# EAGLE schematic Okapi (EAGLE 9.6.2), part 1 of 2

## Sheet 1 of 6
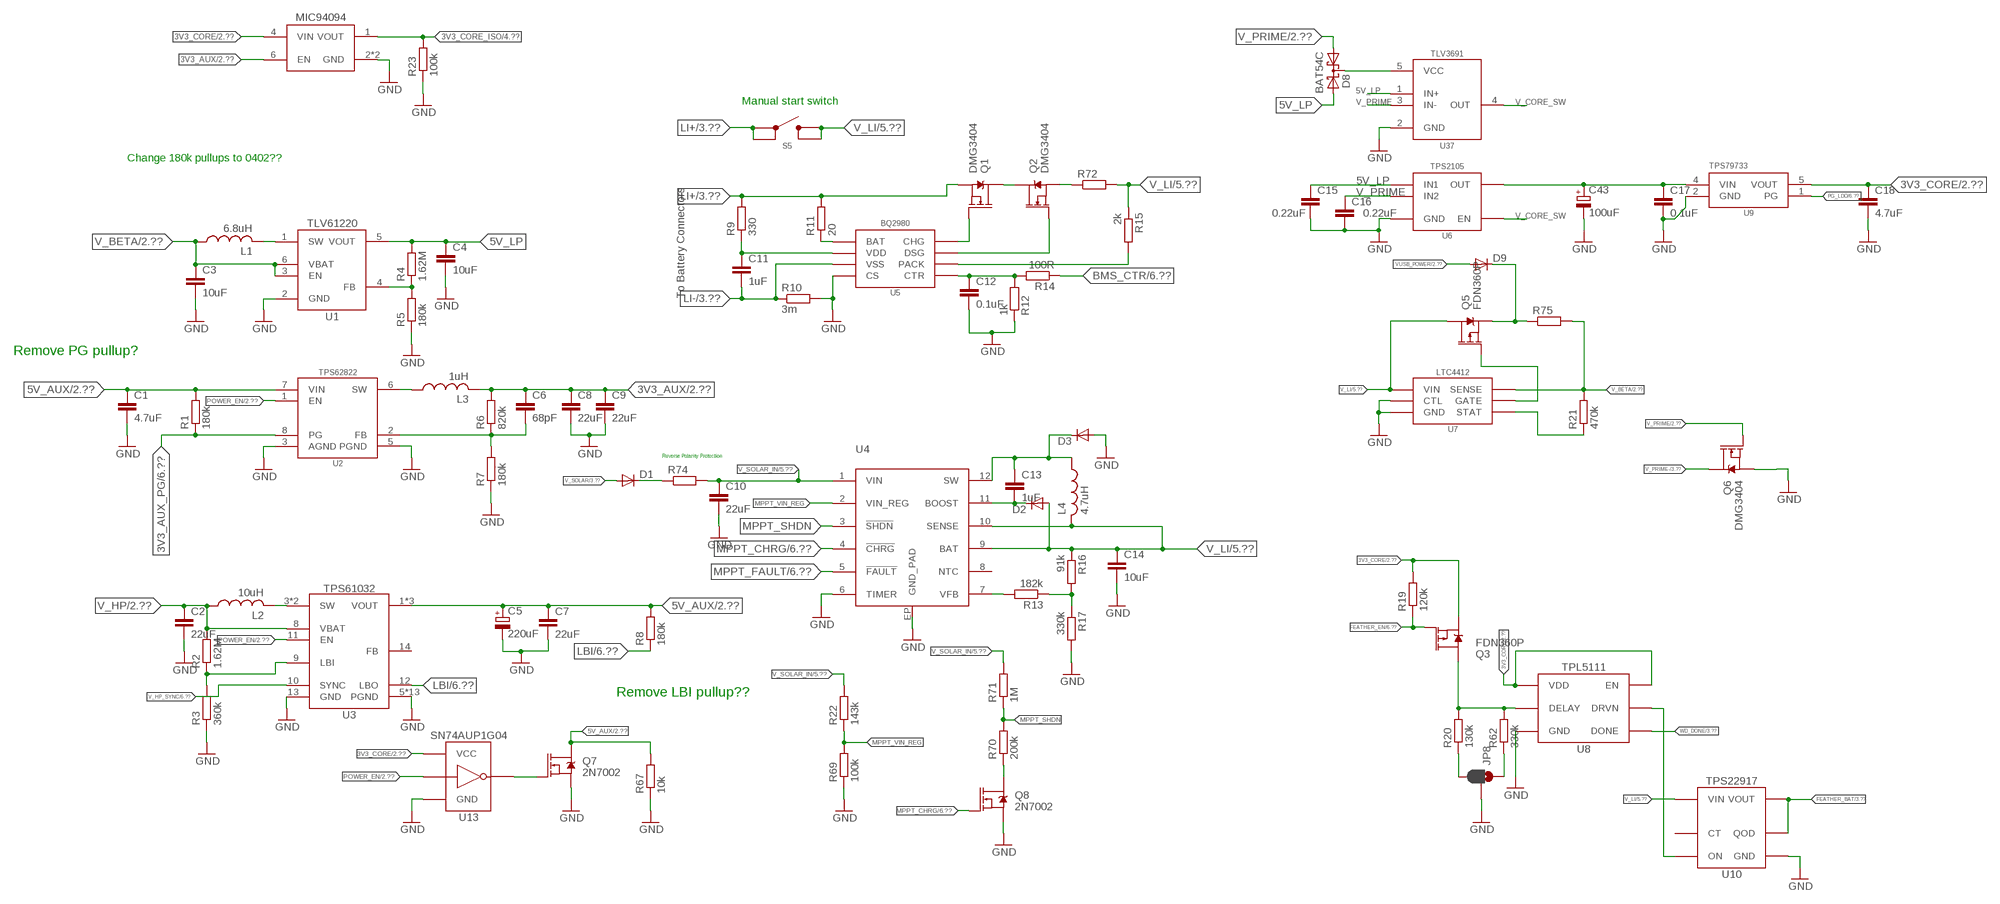
[diagram p0: schematic, sheet 1]

### Parts
C1  4.7uF  C-EU4.7UFC0805  [C0805]
C2  22uF  C-EU22UFC0805  [C0805]
C3  10uF  C-EU10UFC0805  [C0805]
C4  10uF  C-EU10UFC0805  [C0805]
C5  220uF  CTANT_EU2917  [C2917]
C6  68pF  C-EU68PFC0402  [C0402]
C7  22uF  C-EU22UFC0805  [C0805]
C8  22uF  C-EU22UFC0805  [C0805]
C9  22uF  C-EU22UFC0805  [C0805]
C10  22uF  C-EU22UFC0805  [C0805]
C11  1uF  C-EU1UFC0603  [C0603]
C12  0.1uF  C-EU0.1UFC0402  [C0402]
C13  1uF  C-EU1UFC0603  [C0603]
C14  10uF  C-EU10UFC0805  [C0805]
C15  0.22uF  C-EU0.22UFC0402  [C0402]
C16  0.22uF  C-EU0.22UFC0402  [C0402]
C17  0.1uF  C-EU0.1UFC0402  [C0402]
C18  4.7uF  C-EU4.7UFC0603  [C0603]
C43  100uF  CTANT_EU1206  [C1206_TANT]
D1  DIODEDO-214AC  [DO214AC]
D2  DIODESOD-323  [SOD323-R]
D3  DIODEDO-214AC  [DO214AC]
D8  BAT54C  [SOT23-3@1]
D9  DIODEDO-214AC  [DO214AC]
JP8  JUMPER-SMT_3_1-NC_PASTE_SILK  [SMT-JUMPER_3_1-NC_PASTE_SILK]
L1  6.8uH  INDUCTOR_1008  [1008]
L2  10uH  INDUCTOR_XHMI_6.65X6.45  [WE-XHMI(6.65X6.45)]
L3  1uH  INDUCTOR_LQS_3X3  [WE-LQS(3X3)]
L4  4.7uH  INDUCTOR_MAIA_4.1X4.1  [WE-MAIA(4.1X4.1)]
Q1  DMG3404  MOSFET-NCH-DMG3404L  [SOT23-3]
Q2  DMG3404  MOSFET-NCH-DMG3404L  [SOT23-3]
Q3  FDN360P  MOSFET_PCH-FDN360P  [SOT23-3@1]
Q5  FDN360P  MOSFET_PCH-FDN360P  [SOT23-3@1]
Q6  DMG3404  MOSFET-NCH-DMG3404L  [SOT23-3]
Q7  2N7002  MOSFET-NCH-2N7002PW  [SOT323]
Q8  2N7002  MOSFET-NCH-2N7002PW  [SOT323]
R1  180k  R-EU_180KR0603  [R0603]
R2  1.62M  R-EU_1.62MR0603  [R0603]
R3  360k  R-EU_360KR0603  [R0603]
R4  1.62M  R-EU_1.62MR0603  [R0603]
R5  180k  R-EU_180KR0603  [R0603]
R6  820k  R-EU_820KR0603  [R0603]
R7  180k  R-EU_180KR0603  [R0603]
R8  180k  R-EU_180KR0603  [R0603]
R9  330  R-EU_330R0402  [R0402]
R10  3m  R-EU_0.003R0805  [R0805]
R11  20  R-EU_20R0402  [R0402]
R12  1k  R-EU_1KR0402  [R0402]
R13  182k  R-EU_182KR0603  [R0603]
R14  100R  R-EU_100R0402  [R0402]
R15  2k  R-EU_2KR0402  [R0402]
R16  91k  R-EU_91KR0603  [R0603]
R17  330k  R-EU_330KR0603  [R0603]
R19  120k  R-EU_120KR0402  [R0402]
R20  130k  R-EU_130KR0603  [R0603]
R21  470k  R-EU_470KR0603  [R0603]
R22  143k  R-EU_143KR0603  [R0603]
R23  100k  R-EU_100KR0402  [R0402]
R62  330k  R-EU_330KR0603  [R0603]
R67  10k  R-EU_10KR0402  [R0402]
R69  100k  R-EU_100KR0603  [R0603]
R70  200k  R-EU_200KR0603  [R0603]
R71  1M  R-EU_1MR0603  [R0603]
R72  R-EU_R0805  [R0805]
R74  R-EU_R0805  [R0805]
R75  R-EU_R0805  [R0805]
S5  BUTTON2.6X1.6  [SWITCH_2.6X1.6]
U1  TLV61220DBV  [DBV_R-PDSO-G6]
U2  TPS62822DLC  [DLC_8]
U3  TPS61032RSA  [RSA_S-PVQFN-N16]
U4  LT3652DD  [DFN_12_3X3]
U5  BQ2980RUG  [RUG_S-PQFP-N8]
U6  TPS2105  [SOT23-5]
U7  LTC4412S6  [SOT23-6L]
U8  TPL5111DDC  [DDC_R-PDSO-G6]
U9  TPS79733  [DCK_R-PDSO-G5]
U10  TPS22917DBV  [DBV_R-PDSO-G6]
U13  SN74AUP1G04YFP  [DSBGD_4]
U37  TLV3691DCK  [DCK_R-PDSO-G5]
U39  MIC94094C6  [SC-70_6]

### Nets
3V3_AUX: C6.1 C8.1 C9.1 L3.P$2 R6.2 U39.6(EN) ; also sheet 2,3,4,5
3V3_AUX_PG: R1.1 U2.8(PG) ; also sheet 6
3V3_CORE: C18.1 Q3.2(S) R19.2 U8.1(VDD) U8.6(EN) U9.5(VOUT) U13.A2(VCC) U39.4(VIN) ; also sheet 2,3,4,5,6
3V3_CORE_ISO: R23.2 U39.1(VOUT) ; also sheet 4,6
5V_AUX: C1.1 C5.+ C7.1 Q7.3(D) R1.2 R8.2 R67.2 U2.7(VIN) U3.1(VOUT) U3.15(VOUT) U3.16(VOUT) ; also sheet 2,3,4,5,6
5V_LP: C4.1 C15.1 D8.2(A2) R4.2 U1.5(VOUT) U6.5(IN1) U37.1(IN+)
BMS_CTR: R14.1 ; also sheet 6
FEATHER_BAT: U10.5(QOD) U10.6(VOUT) ; also sheet 3
FEATHER_EN: Q3.1(G) R19.1 ; also sheet 6
GND: C1.2 C2.2 C3.2 C4.2 C5.- C7.2 C8.2 C9.2 C10.2 C12.2 C14.2 C15.2 C16.2 C17.2 C18.2 C43.- D3.A JP8.2 Q6.2(S) Q7.2(S) Q8.2(S) R3.1 R5.1 R7.1 R10.2 R12.1 R17.2 R23.1 R67.1 R69.1 U1.2(GND) U2.3(AGND) U2.5(PGND) U3.5(PGND) U3.6(PGND) U3.7(PGND) U3.13(GND) U3.PAD(PGND) U3.PAD@1(PGND) U3.PAD@2(PGND) U3.PAD@3(PGND) U3.PAD@4(PGND) U3.PAD@5(PGND) U3.PAD@6(PGND) U3.PAD@7(PGND) U3.PAD@8(PGND) U3.PAD@9(PGND) U4.6(TIMER) U4.EP(GND_PAD) U5.4(CS) U6.2(GND) U7.2(GND) U7.3(CTL) U8.2(GND) U9.2(GND) U10.2(GND) U13.B1(GND) U37.2(GND) U39.2(GND) U39.5(GND) ; also sheet 2,3,4,5,6
LBI: R8.1 U3.12(LBO) ; also sheet 6
LI+: Q1.2(S) R9.2 R11.2 S5.A S5.A' ; also sheet 3
LI-: C11.2 R10.1 U5.3(VSS) ; also sheet 3
MPPT_CHRG: Q8.1(G) U4.4(!CHRG) ; also sheet 6
MPPT_FAULT: U4.5(!FAULT) ; also sheet 6
MPPT_SHDN: R70.2 R71.1 U4.3(!SHDN)
MPPT_VIN_REG: R22.1 R69.2 U4.2(VIN_REG)
N$2: L3.P$1 U2.6(SW)
N$3: C6.2 R6.1 R7.2 U2.2(FB)
N$4: R2.1 R3.2 U3.9(LBI)
N$5: L2.2 U3.3(SW) U3.4(SW)
N$6: Q1.3(D) Q2.3(D)
N$7: R4.1 R5.2 U1.4(FB)
N$8: Q1.1(G) U5.8(CHG)
N$9: L1.2 U1.1(SW)
N$10: Q2.1(G) U5.7(DSG)
N$11: R15.2 U5.6(PACK)
N$12: R13.1 R16.2 R17.1
N$13: C12.1 R12.2 R14.2 U5.5(CTR)
N$14: R11.1 U5.1(BAT)
N$15: R13.2 U4.7(VFB)
N$16: C11.1 R9.1 U5.2(VDD)
N$18: C13.2 D2.C U4.11(BOOST)
N$19: JP8.3 R20.1
N$20: C13.1 D3.C L4.P$1 U4.12(SW)
N$22: Q8.3(D) R70.1
N$42: JP8.1 R62.1
N$45: Q5.1(G) U7.5(GATE)
N$46: R21.1 U7.4(STAT)
N$63: Q3.3(D) R20.2 R62.2 U8.3(DELAY)
N$64: U8.5(DRVN) U10.3(ON)
N$68: Q7.1(G) U13.B2(Y)
N$69: D8.3(C) U37.5(VCC)
PG_LDO: U9.1(PG) ; also sheet 6
POWER_EN: U2.1(EN) U3.11(EN) U13.A1(A) ; also sheet 2
V_BETA: C3.1 L1.1 R21.2 R75.2 U1.3(EN) U1.6(VBAT) U7.6(SENSE) ; also sheet 2,5
V_BETA_SENSE: D9.C Q5.2(S) R75.1 ; also sheet 5
V_CORE: C17.1 C43.+ U6.4(OUT) U9.4(VIN)
V_CORE_SW: U6.1(EN) U37.4(OUT)
V_HP: C2.1 L2.1 R2.2 U3.8(VBAT) ; also sheet 2
V_HP_SYNC: U3.10(SYNC) ; also sheet 6
V_LI: C14.1 D2.A L4.P$2 Q5.3(D) R15.1 R16.1 R72.2 S5.B S5.B' U4.9(BAT) U4.10(SENSE) U7.1(VIN) U10.1(VIN) ; also sheet 5
V_LI_SENSE: Q2.2(S) R72.1 ; also sheet 5
V_PRIME: C16.1 D8.1(A1) Q6.1(G) U6.3(IN2) U37.3(IN-) ; also sheet 2,3,5
V_PRIME-: Q6.3(D) ; also sheet 3
V_SOLAR: D1.A ; also sheet 3
V_SOLAR_IN: C10.1 R22.2 R71.2 R74.2 U4.1(VIN) ; also sheet 5
V_SOLAR_SENSE: D1.C R74.1 ; also sheet 5
VUSB_POWER: D9.A ; also sheet 2,6
WD_DONE: U8.4(DONE) ; also sheet 3
Unconnected: U3.14(FB) U4.8(NTC) U10.4(CT)

### Notes on the sheet
- Manual start switch
- Change 180k pullups to 0402??
- To Battery Connectors
- Remove PG pullup?
- Reverse Polarity Protection
- Remove LBI pullup??

## Sheet 2 of 6
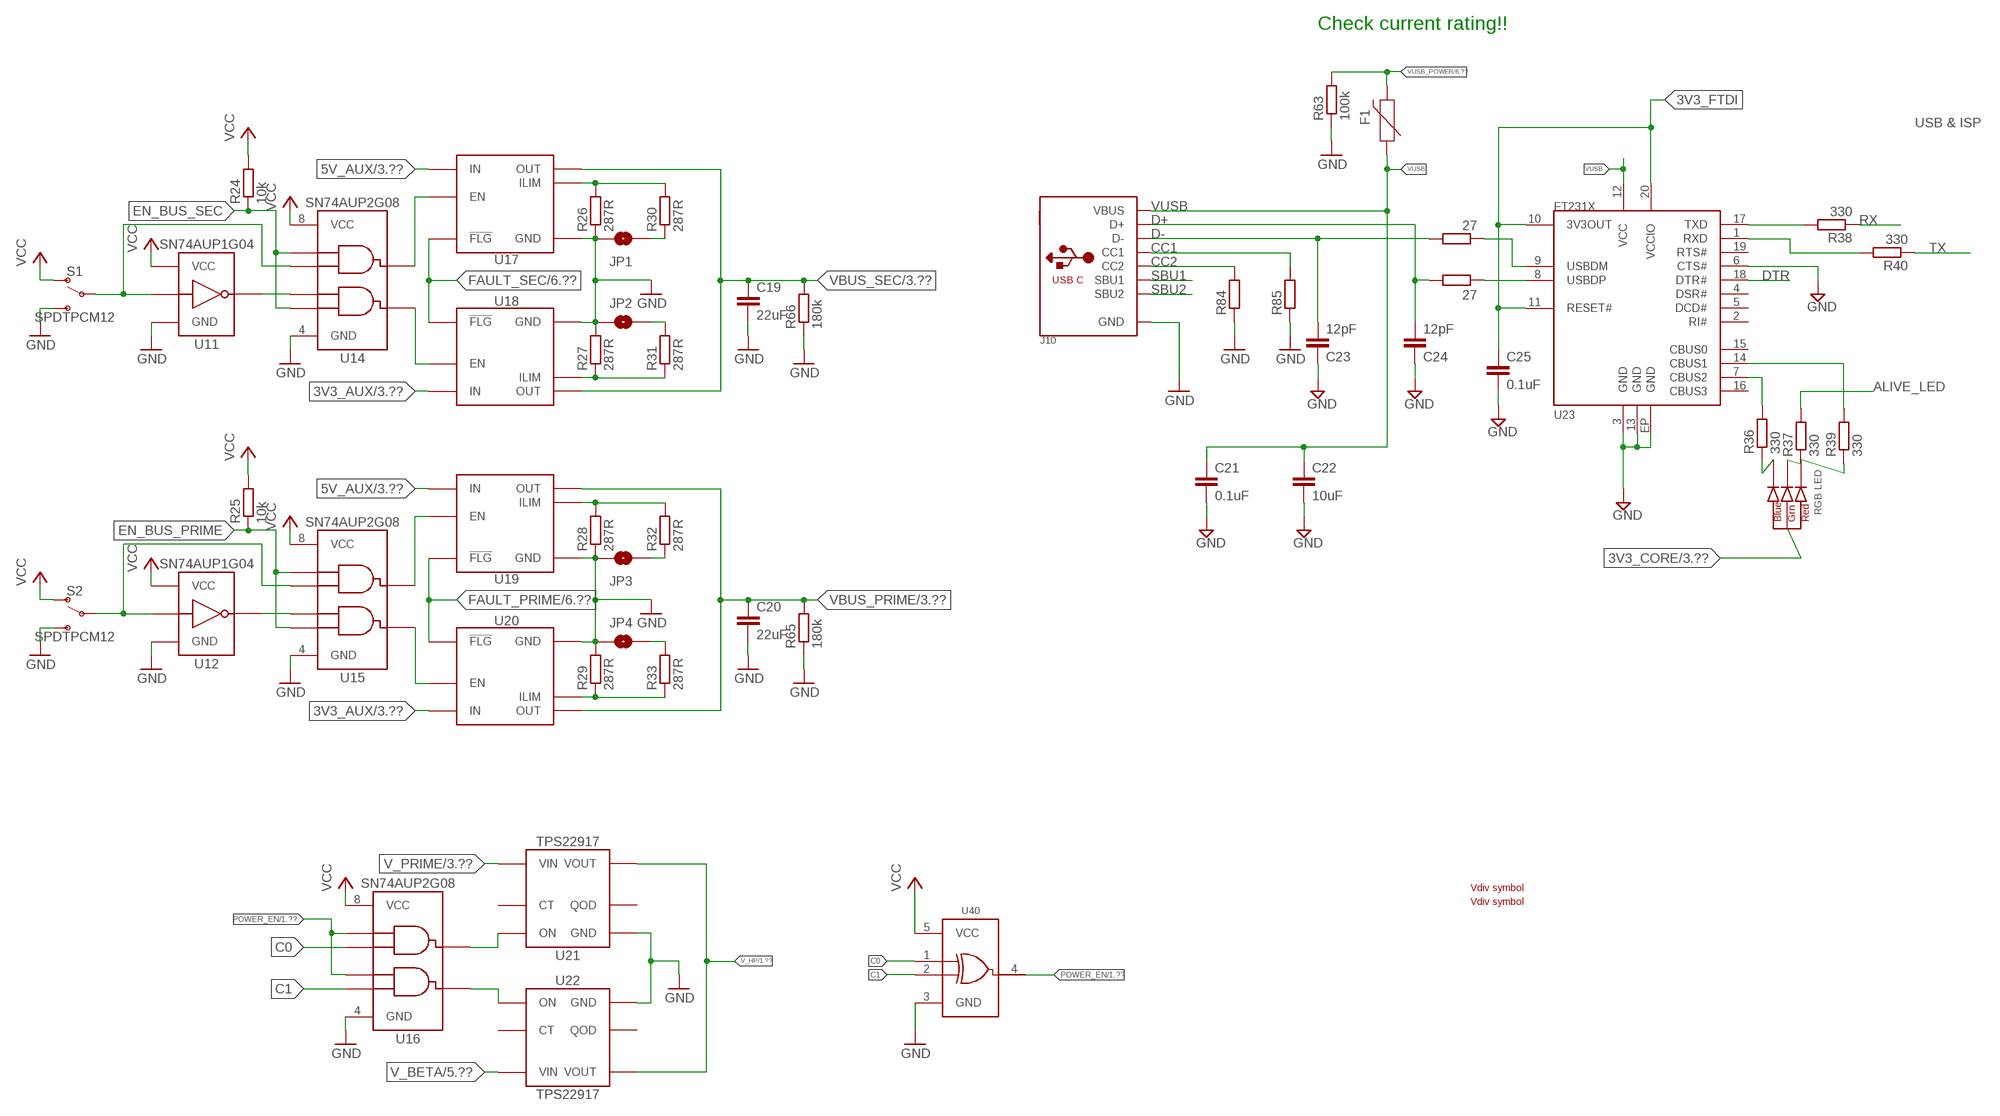
[diagram p1: schematic, sheet 2]

### Parts
C19  22uF  C-EU22UFC0805  [C0805]
C20  22uF  C-EU22UFC0805  [C0805]
C21  0.1uF  C-EU0.1UFC0402  [C0402]
C22  10uF  C-EU10UFC0805  [C0805]
C23  12pF  C-EU12PFC0402  [C0402]
C24  12pF  C-EU12PFC0402  [C0402]
C25  0.1uF  C-EU0.1UFC0402  [C0402]
D4  CLVBA-FKA  [CLVBA-FKA]
F1  PPTC1.5A  [1206]
J10  USB_C  [USB_C_CUSB31-CFM2AX-01-X]
JP1  JUMPER-SMT_2_NO_SILK  [SMT-JUMPER_2_NO_SILK]
JP2  JUMPER-SMT_2_NO_SILK  [SMT-JUMPER_2_NO_SILK]
JP3  JUMPER-SMT_2_NO_SILK  [SMT-JUMPER_2_NO_SILK]
JP4  JUMPER-SMT_2_NO_SILK  [SMT-JUMPER_2_NO_SILK]
R24  10k  R-EU_10KR0402  [R0402]
R25  10k  R-EU_10KR0402  [R0402]
R26  287R  R-EU_232R0402  [R0402]
R27  287R  R-EU_232R0402  [R0402]
R28  287R  R-EU_232R0402  [R0402]
R29  287R  R-EU_232R0402  [R0402]
R30  287R  R-EU_453R0402  [R0402]
R31  287R  R-EU_453R0402  [R0402]
R32  287R  R-EU_453R0402  [R0402]
R33  287R  R-EU_453R0402  [R0402]
R34  27  R-EU_27R0402  [R0402]
R35  27  R-EU_27R0402  [R0402]
R36  330  R-EU_330R0402  [R0402]
R37  330  R-EU_330R0402  [R0402]
R38  330  R-EU_330R0402  [R0402]
R39  330  R-EU_330R0402  [R0402]
R40  330  R-EU_330R0402  [R0402]
R63  100k  R-EU_100KR0402  [R0402]
R65  180k  R-EU_180KR0402  [R0402]
R66  180k  R-EU_180KR0402  [R0402]
R84  R-EU_5.1KR0402  [R0402]
R85  R-EU_5.1KR0402  [R0402]
S1  SPDTPCM12  [PCM12]
S2  SPDTPCM12  [PCM12]
U11  SN74AUP1G04YFP  [DSBGD_4]
U12  SN74AUP1G04YFP  [DSBGD_4]
U14  SN74AUP2G08DQE  [DQE_R-PX2SON-N8]
U15  SN74AUP2G08DQE  [DQE_R-PX2SON-N8]
U16  SN74AUP2G08DQE  [DQE_R-PX2SON-N8]
U17  MIC2544MSOP  [MSOP_8]
U18  MIC2544MSOP  [MSOP_8]
U19  MIC2544MSOP  [MSOP_8]
U20  MIC2544MSOP  [MSOP_8]
U21  TPS22917DBV  [DBV_R-PDSO-G6]
U22  TPS22917DBV  [DBV_R-PDSO-G6]
U23  FT231X-Q  [QFN20]
U40  SN74AHC1G86DCK  [DCK_R-PDSO-G5]
U$1  VDIV-JP  [VDIV_GENERIC]
U$2  VDIV-JP  [VDIV_GENERIC]

### Nets
3V3_AUX: R24.2 R25.2 S1.1(O) S2.1(O) U11.A2(VCC) U12.A2(VCC) U14.8(VCC) U15.8(VCC) U18.7(IN) U20.7(IN) ; supply symbol labelled VCC ; also sheet 1,3,4,5
3V3_CORE: D4.2(ANODE) U16.8(VCC) U40.5(VCC) ; supply symbol labelled VCC ; also sheet 1,3,4,5,6
3V3_FTDI: C25.1 U23.10(3V3OUT) U23.11(RESET#) U23.20(VCCIO)
5V_AUX: U17.7(IN) U19.7(IN) ; also sheet 1,3,4,5,6
ALIVE_LED: R37.2 ; also sheet 6
C0: U16.2(B1) U40.1(A) ; also sheet 6
C1: U16.6(B2) U40.2(B) ; also sheet 6
CC1: J10.A5(CC1) R85.2
CC2: J10.B5(CC2) R84.2
D+: C24.2 J10.A6(D+) J10.B6(D+) R35.2
D-: C23.2 J10.A7(D-) J10.B7(D-) R34.2
DTR: U23.18(DTR#) ; also sheet 6
EN_BUS_PRIME: R25.1 U15.1(A1) U15.6(B2) ; also sheet 6
EN_BUS_SEC: R24.1 U14.1(A1) U14.6(B2) ; also sheet 6
FAULT_PRIME: U19.2(!FLG) U20.2(!FLG) ; also sheet 6
FAULT_SEC: U17.2(!FLG) U18.2(!FLG) ; also sheet 6
GND: C19.2 C20.2 C21.2 C22.2 C23.1 C24.1 C25.2 J10.A1B12(GND) J10.B1A12(GND) JP1.1 JP2.1 JP3.1 JP4.1 R26.1 R27.2 R28.1 R29.2 R63.1 R65.1 R66.1 R84.1 R85.1 S1.3(S) S2.3(S) U11.B1(GND) U12.B1(GND) U14.4(GND) U15.4(GND) U16.4(GND) U17.3(GND) U18.3(GND) U19.3(GND) U20.3(GND) U21.2(GND) U22.2(GND) U23.3(GND) U23.6(CTS#) U23.13(GND) U23.EP(GND) U40.3(GND) ; also sheet 1,3,4,5,6
N$23: U16.7(Y1) U21.3(ON)
N$24: U16.3(Y2) U22.3(ON)
N$26: U12.B2(Y) U15.5(A2)
N$27: R28.2 R32.2 U19.5(ILIM)
N$28: S2.2(P) U12.A1(A) U15.2(B1)
N$29: U15.7(Y1) U19.1(EN)
N$30: U15.3(Y2) U20.1(EN)
N$31: JP3.2 R32.1
N$32: JP4.2 R33.2
N$33: R29.1 R33.1 U20.5(ILIM)
N$34: U11.B2(Y) U14.5(A2)
N$35: S1.2(P) U11.A1(A) U14.2(B1)
N$36: U14.7(Y1) U17.1(EN)
N$37: U14.3(Y2) U18.1(EN)
N$38: R26.2 R30.2 U17.5(ILIM)
N$39: JP1.2 R30.1
N$40: JP2.2 R31.2
N$41: R27.1 R31.1 U18.5(ILIM)
N$44: R38.2 U23.17(TXD)
N$47: R40.2 U23.1(RXD)
N$50: R35.1 U23.8(USBDP)
N$51: R39.2 U23.14(CBUS1)
N$52: R34.1 U23.9(USBDM)
N$53: D4.1(RED_CATH) R39.1
N$54: D4.3(BLUE_CATH) R36.1
N$56: D4.4(GREEN_CATH) R37.1
N$57: R36.2 U23.7(CBUS2)
POWER_EN: U16.1(A1) U16.5(A2) U40.4(Y) ; also sheet 1
RX: R38.1 ; also sheet 3,6
SBU1: J10.A8(SBU1)
SBU2: J10.B8(SBU2)
TX: R40.1 ; also sheet 3,6
V_BETA: U22.1(VIN) ; also sheet 1,5
V_HP: U21.6(VOUT) U22.6(VOUT) ; also sheet 1
V_PRIME: U21.1(VIN) ; also sheet 1,3,5
VBUS_PRIME: C20.1 R65.2 U19.6(OUT) U19.8(OUT) U20.6(OUT) U20.8(OUT) ; also sheet 3,4
VBUS_SEC: C19.1 R66.2 U17.6(OUT) U17.8(OUT) U18.6(OUT) U18.8(OUT) ; also sheet 3,4
VUSB: C21.1 C22.1 F1.1 J10.A4B9(VBUS) J10.B4A9(VBUS) U23.12(VCC)
VUSB_POWER: F1.2 R63.2 ; also sheet 1,6
Unconnected: U21.4(CT) U22.4(CT) U23.2(RI#) U23.4(DSR#) U23.5(DCD#) U23.15(CBUS0) U23.16(CBUS3) U23.19(RTS#)

### Notes on the sheet
- Check current rating!!
- USB & ISP

## Sheet 3 of 6
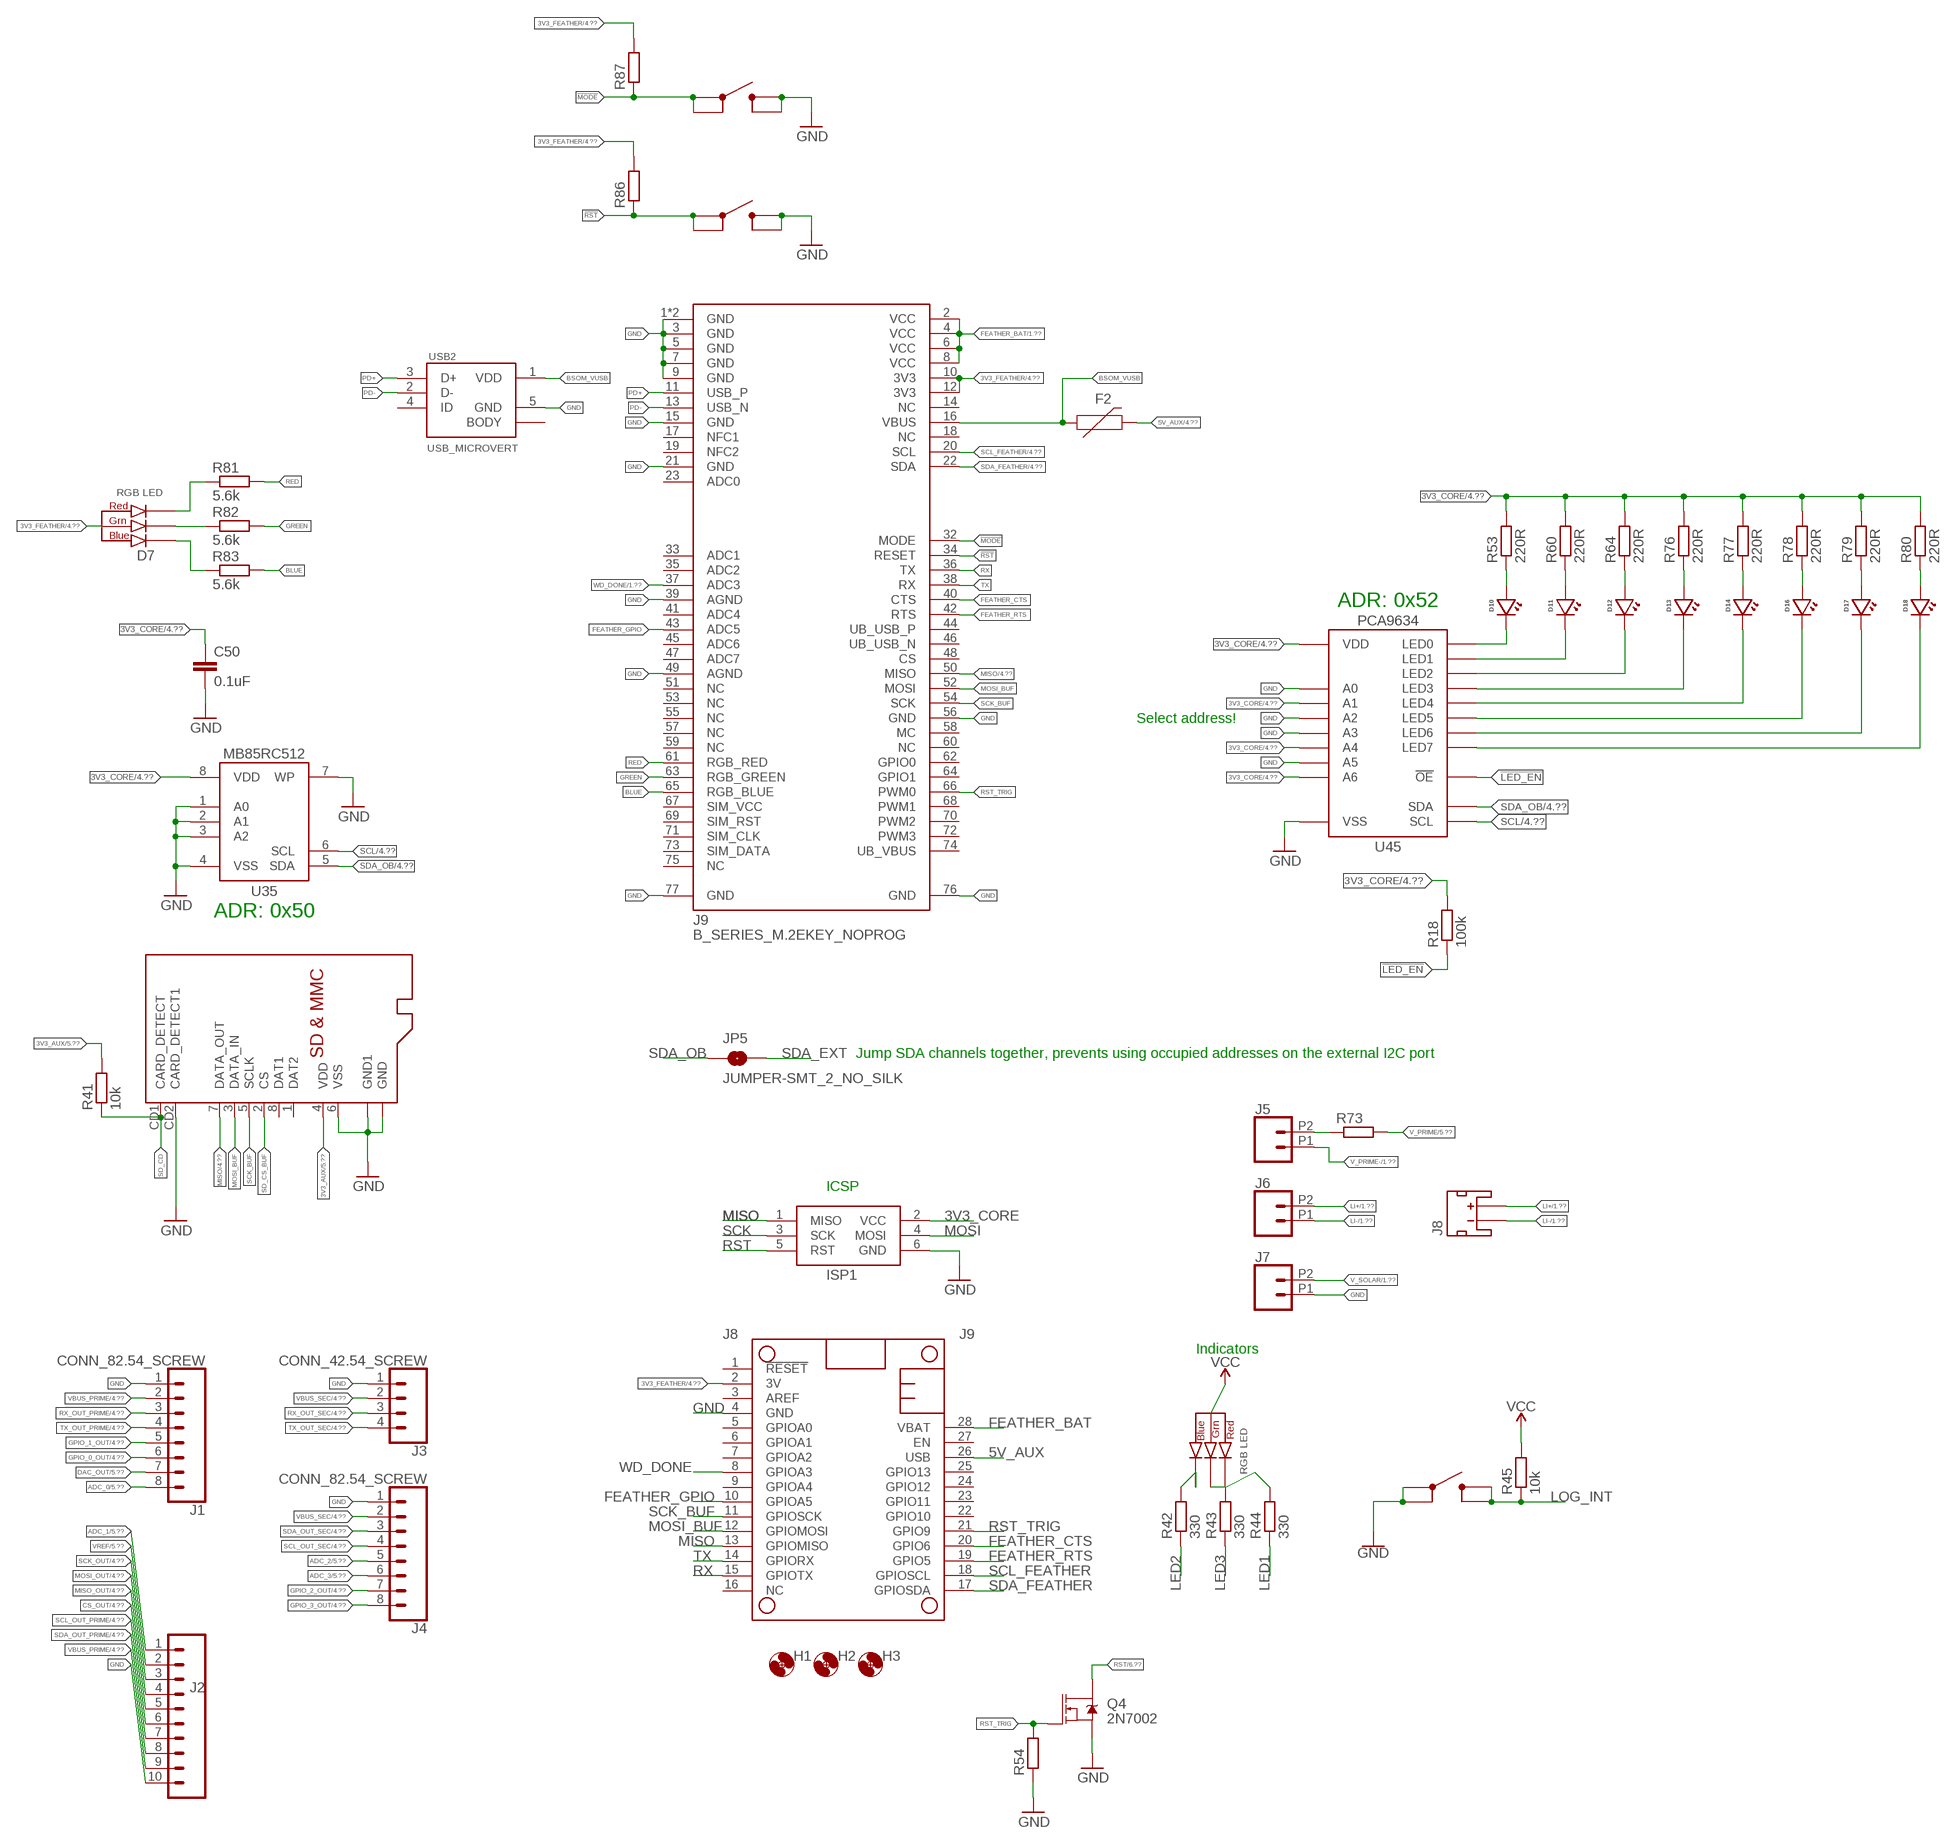
[diagram p2: schematic, sheet 3]

### Parts
C50  0.1uF  C-EU0.1UFC0402  [C0402]
D5  CLVBA-FKA  [CLVBA-FKA]
D7  CLVBA-FKA  [CLVBA-FKA]
D10  LEDGREEN0603  [LED_0603]
D11  LEDYELLOW0603  [LED_0603]
D12  LEDRED0603  [LED_0603]
D13  LEDGREEN0603  [LED_0603]
D14  LEDYELLOW0603  [LED_0603]
D16  LEDGREEN0603  [LED_0603]
D17  LEDYELLOW0603  [LED_0603]
D18  LEDRED0603  [LED_0603]
F2  PPTC1.5A  [1206]
H1  MOUNTING_HOLE4_NP  [4_40]
H2  MOUNTING_HOLE4_NP  [4_40]
H3  MOUNTING_HOLE4_NP  [4_40]
ISP1  AVRISP-6  [AVRISP]
J1  CONN_82.54_SCREW  [1X08_SCREW]
J2  CONN_102.54_SCREW  [1X10_SCREW]
J3  CONN_42.54_SCREW  [1X04_SCREW]
J4  CONN_82.54_SCREW  [1X08_SCREW]
J5  CONN_022.54_SCREW  [1X02_2.54_SCREWTERM]
J6  CONN_022.54_SCREW  [1X02_2.54_SCREWTERM]
J7  CONN_022.54_SCREW  [1X02_2.54_SCREWTERM]
J8  JST_2MM_MALE  [JST-2-SMD]
J9  B_SERIES_M.2EKEY_NOPROG  [PARTICLE_M.2EKEY_NOPROG]
JP5  JUMPER-SMT_2_NO_SILK  [SMT-JUMPER_2_NO_SILK]
MS1  FEATHERWINGLAYOUT  [FEATHERWING_MIN]
Q4  2N7002  MOSFET-NCH-2N7002PW  [SOT323]
R18  100k  R-EU_100KR0402  [R0402]
R41  10k  R-EU_10KR0402  [R0402]
R42  330  R-EU_330R0402  [R0402]
R43  330  R-EU_330R0402  [R0402]
R44  330  R-EU_330R0402  [R0402]
R45  10k  R-EU_10KR0402  [R0402]
R53  220R  R-EU_220R0402  [R0402]
R54  R-EU_10KR0402  [R0402]
R60  220R  R-EU_220R0402  [R0402]
R64  220R  R-EU_220R0402  [R0402]
R73  R-EU_R0805  [R0805]
R76  220R  R-EU_220R0402  [R0402]
R77  220R  R-EU_220R0402  [R0402]
R78  220R  R-EU_220R0402  [R0402]
R79  220R  R-EU_220R0402  [R0402]
R80  220R  R-EU_220R0402  [R0402]
R81  5.6k  R-EU_5.6KR0402  [R0402]
R82  5.6k  R-EU_5.6KR0402  [R0402]
R83  5.6k  R-EU_5.6KR0402  [R0402]
R86  R-EU_10KR0402  [R0402]
R87  R-EU_10KR0402  [R0402]
S3  BUTTON4.2X3.2  [SWITCH_4.2X3.2]
S6  BUTTON4.2X3.2  [SWITCH_4.2X3.2]
S7  BUTTON4.2X3.2  [SWITCH_4.2X3.2]
SD1  MICROSDCD  [MICROSD_CD]
U35  MB85RC  [SO08]
U45  PCA9634QFN  [QFN20_5X5]
USB2  USB_MICROVERT  [USB_MICRO_VERT_MOLEX]

### Nets
3V3_AUX: R41.2 SD1.4(VDD) ; also sheet 1,2,4,5
3V3_CORE: C50.1 D5.2(ANODE) ISP1.2(VCC) R18.2 R45.2 R53.2 R60.2 R64.2 R76.2 R77.2 R78.2 R79.2 R80.2 U35.8(VDD) U45.3(A4) U45.15(A6) U45.18(VDD) U45.20(A1) ; supply symbol labelled VCC ; also sheet 1,2,4,5,6
3V3_FEATHER: D7.2(ANODE) J9.10(3V3) J9.12(3V3) MS1.2(3V) R86.2 R87.2 ; also sheet 4
5V_AUX: F2.2 MS1.26(USB) ; also sheet 1,2,4,5,6
!LED_EN: R18.1 U45.13(!OE) ; also sheet 6
!MODE: J9.32(MODE) R87.1 S6.1 S6.2
!RST: J9.34(RESET) R86.1 S7.1 S7.2
ADC_0: J1.8 ; also sheet 5
ADC_1: J2.1 ; also sheet 5
ADC_2: J4.5 ; also sheet 5
ADC_3: J4.6 ; also sheet 5
BLUE: J9.65(RGB_BLUE) R83.2
BSOM_VUSB: F2.1 J9.16(VBUS) USB2.1(VDD)
CS_OUT: J2.6 ; also sheet 4
DAC_OUT: J1.7 ; also sheet 5
FEATHER_BAT: J9.2(VCC) J9.4(VCC) J9.6(VCC) J9.8(VCC) MS1.28(VBAT) ; also sheet 1
FEATHER_CTS: J9.40(CTS) MS1.20(GPIO6) ; also sheet 6
FEATHER_GPIO: J9.43(ADC5) MS1.10(GPIOA5) ; also sheet 6
FEATHER_RTS: J9.42(RTS) MS1.19(GPIO5) ; also sheet 6
GND: C50.2 ISP1.6(GND) J1.1 J2.10 J3.1 J4.1 J7.P1 J9.1(GND) J9.3(GND) J9.5(GND) J9.7(GND) J9.9(GND) J9.15(GND) J9.21(GND) J9.39(AGND) J9.49(AGND) J9.56(GND) J9.76(GND) J9.77(GND) J9.GND MS1.4(GND) Q4.2(S) R54.1 S3.1 S3.2 S6.3 S6.4 S7.3 S7.4 SD1.6(VSS) SD1.CD2(CARD_DETECT1) SD1.MT1(GND) SD1.MT2(GND1) SD1.MT3(GND1) SD1.MT4(GND1) U35.1(A0) U35.2(A1) U35.3(A2) U35.4(VSS) U35.7(WP) U45.1(A2) U45.2(A3) U45.8(VSS) U45.14(A5) U45.19(A0) U45.EP(VSS) USB2.5(GND) ; also sheet 1,2,4,5,6
GPIO_0_OUT: J1.6 ; also sheet 4
GPIO_1_OUT: J1.5 ; also sheet 4
GPIO_2_OUT: J4.7 ; also sheet 4
GPIO_3_OUT: J4.8 ; also sheet 4
GREEN: J9.63(RGB_GREEN) R82.2
LED1: R44.1 ; also sheet 6
LED2: R42.1 ; also sheet 6
LED3: R43.1 ; also sheet 6
LI+: J6.P2 J8.2(+) ; also sheet 1
LI-: J6.P1 J8.1(-) ; also sheet 1
LOG_INT: R45.1 S3.3 S3.4 ; also sheet 6
MISO: ISP1.1(MISO) J9.50(MISO) MS1.13(GPIOMISO) SD1.7(DATA_OUT) ; also sheet 4,6
MISO_OUT: J2.5 ; also sheet 4
MOSI: ISP1.4(MOSI) ; also sheet 4,6
MOSI_BUF: J9.52(MOSI) MS1.12(GPIOMOSI) SD1.3(DATA_IN) ; also sheet 4
MOSI_OUT: J2.4 ; also sheet 4
N$25: D10.CATHODE U45.4(LED0)
N$58: D5.3(BLUE_CATH) R42.2
N$59: D5.4(GREEN_CATH) R43.2
N$60: D5.1(RED_CATH) R44.2
N$67: D11.CATHODE U45.5(LED1)
N$70: D12.CATHODE U45.6(LED2)
N$71: D13.CATHODE U45.7(LED3)
N$72: D14.CATHODE U45.9(LED4)
N$73: D16.CATHODE U45.10(LED5)
N$74: D17.CATHODE U45.11(LED6)
N$75: D18.CATHODE U45.12(LED7)
N$76: D10.ANODE R53.1
N$77: D11.ANODE R60.1
N$78: D12.ANODE R64.1
N$79: D13.ANODE R76.1
N$80: D14.ANODE R77.1
N$81: D16.ANODE R78.1
N$82: D17.ANODE R79.1
N$83: D18.ANODE R80.1
N$84: D7.1(RED_CATH) R81.1
N$85: D7.4(GREEN_CATH) R82.1
N$86: D7.3(BLUE_CATH) R83.1
PD+: J9.11(USB_P) USB2.3(D+)
PD-: J9.13(USB_N) USB2.2(D-)
RED: J9.61(RGB_RED) R81.2
RST: ISP1.5(RST) Q4.3(D) ; also sheet 6
RST_TRIG: J9.66(PWM0) MS1.21(GPIO9) Q4.1(G) R54.2
RX: J9.36(TX) MS1.15(GPIOTX) ; also sheet 2,6
RX_OUT_PRIME: J1.3 ; also sheet 4
RX_OUT_SEC: J3.3 ; also sheet 4
SCK: ISP1.3(SCK) ; also sheet 4,6
SCK_BUF: J9.54(SCK) MS1.11(GPIOSCK) SD1.5(SCLK) ; also sheet 4
SCK_OUT: J2.3 ; also sheet 4
SCL: U35.6(SCL) U45.16(SCL) ; also sheet 4,5,6
SCL_FEATHER: J9.20(SCL) MS1.18(GPIOSCL) ; also sheet 4
SCL_OUT_PRIME: J2.7 ; also sheet 4
SCL_OUT_SEC: J4.4 ; also sheet 4
SD_CD: R41.1 SD1.CD1(CARD_DETECT) ; also sheet 6
SD_CS_BUF: SD1.2(CS) ; also sheet 4
SDA_EXT: JP5.2 ; also sheet 4
SDA_FEATHER: J9.22(SDA) MS1.17(GPIOSDA) ; also sheet 4
SDA_OB: JP5.1 U35.5(SDA) U45.17(SDA) ; also sheet 4,5,6
SDA_OUT_PRIME: J2.8 ; also sheet 4
SDA_OUT_SEC: J4.3 ; also sheet 4
TX: J9.38(RX) MS1.14(GPIORX) ; also sheet 2,6
TX_OUT_PRIME: J1.4 ; also sheet 4
TX_OUT_SEC: J3.4 ; also sheet 4
V_PRIME: R73.2 ; also sheet 1,2,5
V_PRIME-: J5.P1 ; also sheet 1
V_PRIME_SENSE: J5.P2 R73.1 ; also sheet 5
V_SOLAR: J7.P2 ; also sheet 1
VBUS_PRIME: J1.2 J2.9 ; also sheet 2,4
VBUS_SEC: J3.2 J4.2 ; also sheet 2,4
VREF: J2.2 ; also sheet 5
WD_DONE: J9.37(ADC3) MS1.8(GPIOA3) ; also sheet 1
Unconnected: J8.NC1(PAD1) J8.NC2(PAD2) J9.14(NC) J9.17(NFC1) J9.18(NC) J9.19(NFC2) J9.23(ADC0) J9.33(ADC1) J9.35(ADC2) J9.41(ADC4) J9.44(UB_USB_P) J9.45(ADC6) J9.46(UB_USB_N) J9.47(ADC7) J9.48(CS) J9.51(NC) J9.53(NC) J9.55(NC) J9.57(NC) J9.58(MC) J9.59(NC) J9.60(NC) J9.62(GPIO0) J9.64(GPIO1) J9.68(PWM1) J9.69(SIM_RST) J9.70(PWM2) J9.71(SIM_CLK) J9.72(PWM3) J9.73(SIM_DATA) J9.75(NC) MS1.1(!RESET) MS1.3(AREF) MS1.5(GPIOA0) MS1.6(GPIOA1) MS1.7(GPIOA2) MS1.9(GPIOA4) MS1.16(NC) MS1.22(GPIO10) MS1.23(GPIO11) MS1.24(GPIO12) MS1.25(GPIO13) MS1.27(EN) SD1.1(DAT2) SD1.8(DAT1) USB2.4(ID) USB2.P$1(BODY) USB2.P$2(BODY) USB2.P$3(BODY) USB2.P$4(BODY) USB2.P$5(BODY) USB2.P$6(BODY)

### Notes on the sheet
- ADR: 0x52
- Select address!
- ADR: 0x50
- Jump SDA channels together, prevents using occupied addresses on the external I2C port
- ICSP
- J8 | J9
- Indicators

## Sheet 4 of 6
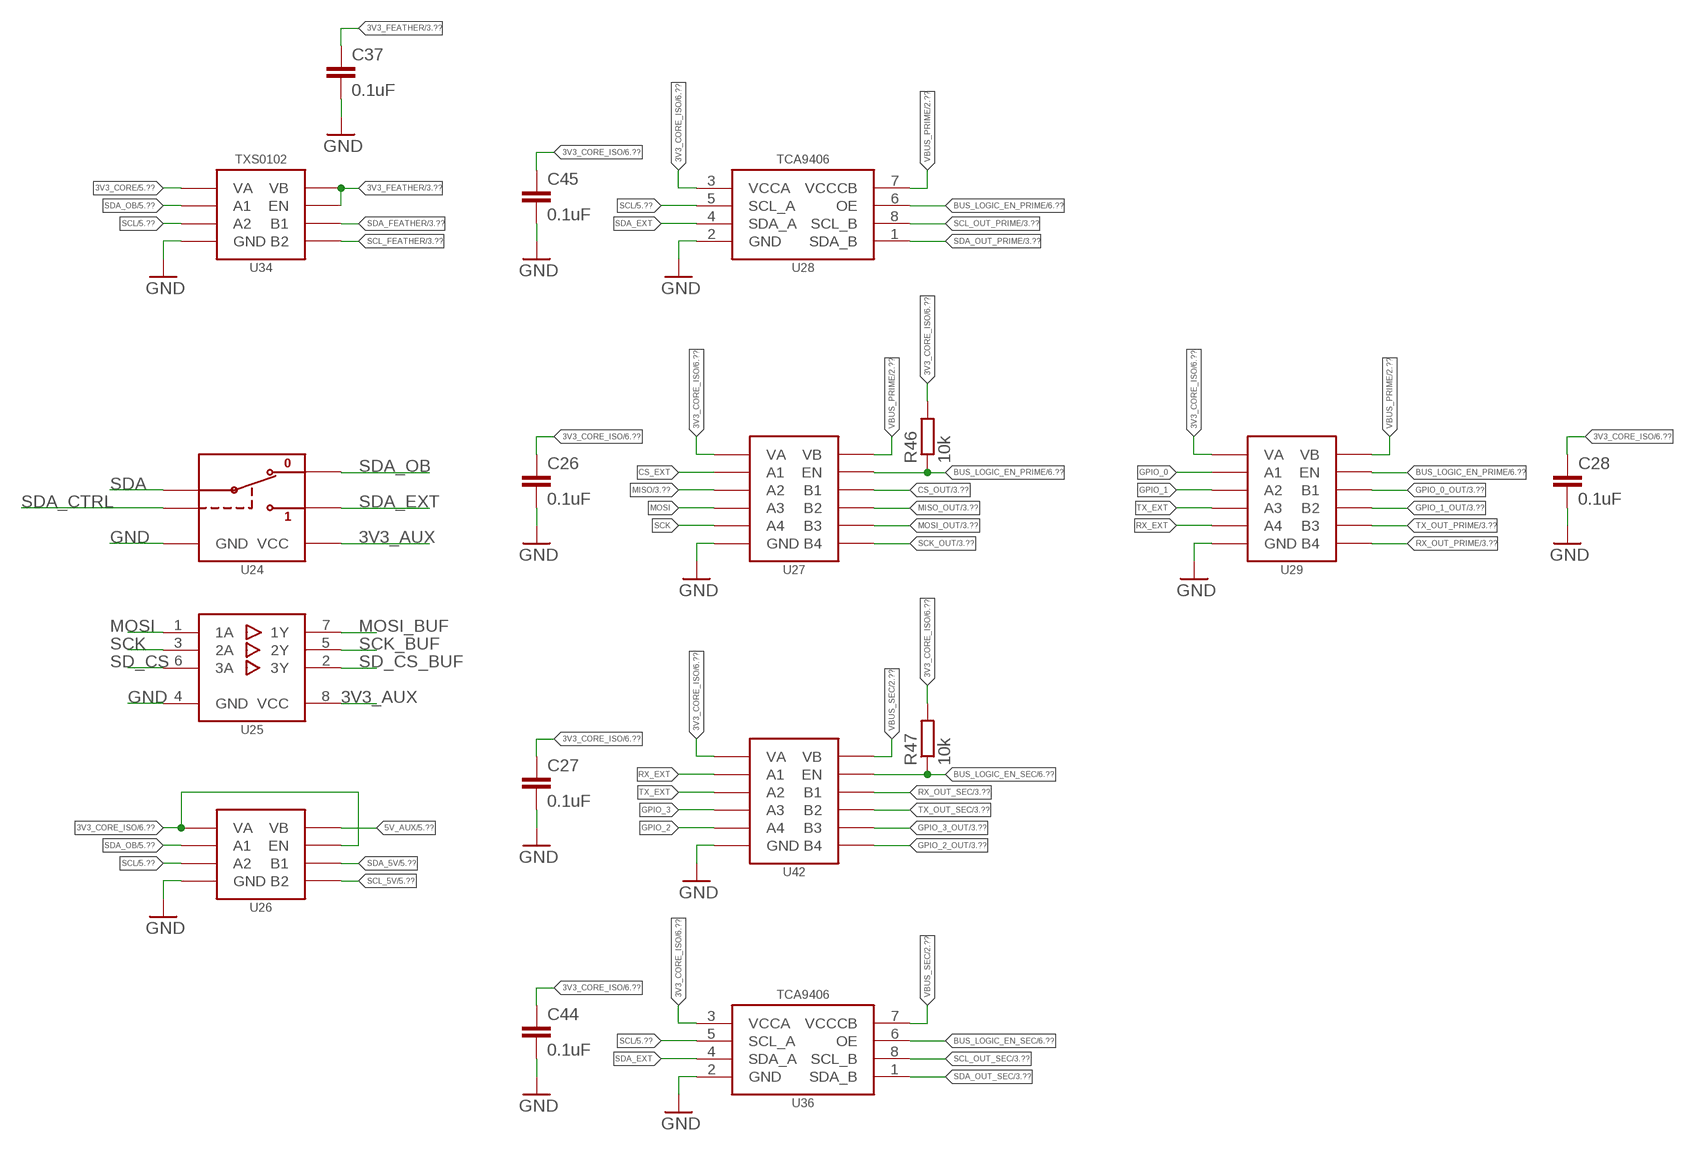
[diagram p3: schematic, sheet 4]

### Parts
C26  0.1uF  C-EU0.1UFC0402  [C0402]
C27  0.1uF  C-EU0.1UFC0402  [C0402]
C28  0.1uF  C-EU0.1UFC0402  [C0402]
C37  0.1uF  C-EU0.1UFC0402  [C0402]
C44  0.1uF  C-EU0.1UFC0402  [C0402]
C45  0.1uF  C-EU0.1UFC0402  [C0402]
R46  10k  R-EU_10KR0402  [R0402]
R47  10k  R-EU_10KR0402  [R0402]
U24  SN74LVC1G3157DRL  [DRL_R-PDSO-N6]
U25  SN74AUP3G34DCU  [DCU_(R-PDSO-G8)]
U26  TXS0102DQM  [DQM_R-PX2SON-N8]
U27  TXS0104RGY  [RGY_S-PVQFN-N14]
U28  TCA9406DCU  [DCU_(R-PDSO-G8)]
U29  TXS0104RGY  [RGY_S-PVQFN-N14]
U34  TXS0102DQM  [DQM_R-PX2SON-N8]
U36  TCA9406DCU  [DCU_(R-PDSO-G8)]
U42  TXS0104RGY  [RGY_S-PVQFN-N14]

### Nets
3V3_AUX: U24.5(VCC) U25.8(VCC) ; also sheet 1,2,3,5
3V3_CORE: U34.1(VA) ; also sheet 1,2,3,5,6
3V3_CORE_ISO: C26.1 C27.1 C28.1 C44.1 C45.1 R46.2 R47.2 U26.1(VA) U26.5(EN) U27.1(VA) U28.3(VCCA) U29.1(VA) U36.3(VCCA) U42.1(VA) ; also sheet 1,6
3V3_FEATHER: C37.1 U34.5(EN) U34.8(VB) ; also sheet 3
5V_AUX: U26.8(VB) ; also sheet 1,2,3,5,6
BUS_LOGIC_EN_PRIME: R46.1 U27.8(EN) U28.6(OE) U29.8(EN) ; also sheet 6
BUS_LOGIC_EN_SEC: R47.1 U36.6(OE) U42.8(EN) ; also sheet 6
CS_EXT: U27.2(A1) ; also sheet 6
CS_OUT: U27.13(B1) ; also sheet 3
GND: C26.2 C27.2 C28.2 C37.2 C44.2 C45.2 U24.2(GND) U25.4(GND) U26.4(GND) U27.7(GND) U27.EP(GND) U28.2(GND) U29.7(GND) U29.EP(GND) U34.4(GND) U36.2(GND) U42.7(GND) U42.EP(GND) ; also sheet 1,2,3,5,6
GPIO_0: U29.2(A1) ; also sheet 6
GPIO_0_OUT: U29.13(B1) ; also sheet 3
GPIO_1: U29.3(A2) ; also sheet 6
GPIO_1_OUT: U29.12(B2) ; also sheet 3
GPIO_2: U42.5(A4) ; also sheet 6
GPIO_2_OUT: U42.10(B4) ; also sheet 3
GPIO_3: U42.4(A3) ; also sheet 6
GPIO_3_OUT: U42.11(B3) ; also sheet 3
MISO: U27.3(A2) ; also sheet 3,6
MISO_OUT: U27.12(B2) ; also sheet 3
MOSI: U25.1(1A) U27.4(A3) ; also sheet 3,6
MOSI_BUF: U25.7(1Y) ; also sheet 3
MOSI_OUT: U27.11(B3) ; also sheet 3
RX_EXT: U29.5(A4) U42.2(A1) ; also sheet 6
RX_OUT_PRIME: U29.10(B4) ; also sheet 3
RX_OUT_SEC: U42.13(B1) ; also sheet 3
SCK: U25.3(2A) U27.5(A4) ; also sheet 3,6
SCK_BUF: U25.5(2Y) ; also sheet 3
SCK_OUT: U27.10(B4) ; also sheet 3
SCL: U26.3(A2) U28.5(SCL_A) U34.3(A2) U36.5(SCL_A) ; also sheet 3,5,6
SCL_5V: U26.6(B2) ; also sheet 5
SCL_FEATHER: U34.6(B2) ; also sheet 3
SCL_OUT_PRIME: U28.8(SCL_B) ; also sheet 3
SCL_OUT_SEC: U36.8(SCL_B) ; also sheet 3
SD_CS: U25.6(3A) ; also sheet 6
SD_CS_BUF: U25.2(3Y) ; also sheet 3
SDA: U24.4(A) ; also sheet 6
SDA_5V: U26.7(B1) ; also sheet 5
SDA_CTRL: U24.6(S) ; also sheet 6
SDA_EXT: U24.1(B2) U28.4(SDA_A) U36.4(SDA_A) ; also sheet 3
SDA_FEATHER: U34.7(B1) ; also sheet 3
SDA_OB: U24.3(B1) U26.2(A1) U34.2(A1) ; also sheet 3,5,6
SDA_OUT_PRIME: U28.1(SDA_B) ; also sheet 3
SDA_OUT_SEC: U36.1(SDA_B) ; also sheet 3
TX_EXT: U29.4(A3) U42.3(A2) ; also sheet 6
TX_OUT_PRIME: U29.11(B3) ; also sheet 3
TX_OUT_SEC: U42.12(B2) ; also sheet 3
VBUS_PRIME: U27.14(VB) U28.7(VCCCB) U29.14(VB) ; also sheet 2,3
VBUS_SEC: U36.7(VCCCB) U42.14(VB) ; also sheet 2,3

## Sheet 5 of 6
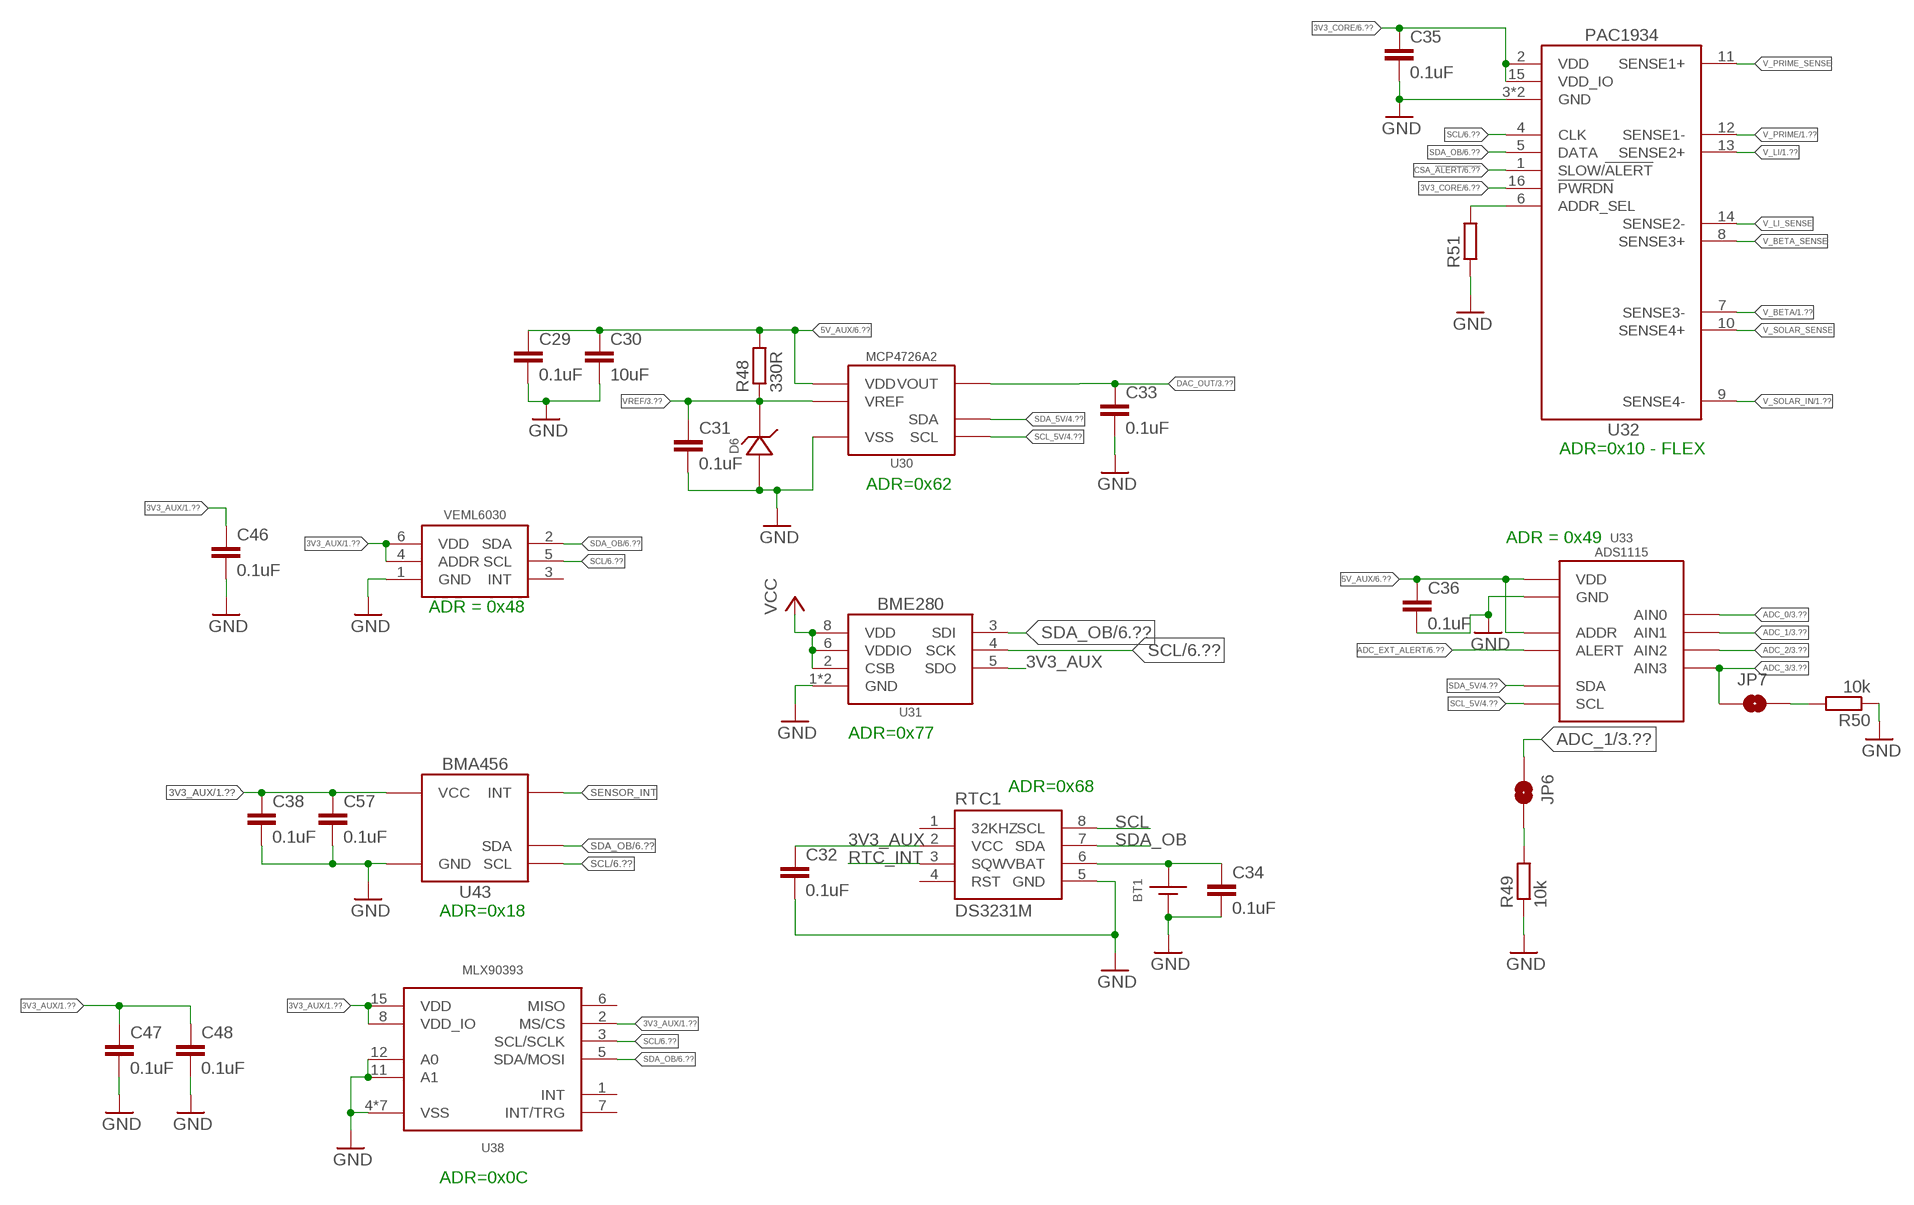
[diagram p4: schematic, sheet 5]

### Parts
BT1  BATTERY_COIN12MM  [LINX_BAT-HLD-012-SMT]
C29  0.1uF  C-EU0.1UFC0402  [C0402]
C30  10uF  C-EU10UFC0805  [C0805]
C31  0.1uF  C-EU0.1UFC0402  [C0402]
C32  0.1uF  C-EU0.1UFC0402  [C0402]
C33  0.1uF  C-EU0.1UFC0402  [C0402]
C34  0.1uF  C-EU0.1UFC0402  [C0402]
C35  0.1uF  C-EU0.1UFC0402  [C0402]
C36  0.1uF  C-EU0.1UFC0402  [C0402]
C38  0.1uF  C-EU0.1UFC0402  [C0402]
C46  0.1uF  C-EU0.1UFC0402  [C0402]
C47  0.1uF  C-EU0.1UFC0402  [C0402]
C48  0.1uF  C-EU0.1UFC0402  [C0402]
C57  0.1uF  C-EU0.1UFC0402  [C0402]
D6  LM40402.5  [SOT23-3]
JP6  JUMPER-SMT_2_NO_SILK  [SMT-JUMPER_2_NO_SILK]
JP7  JUMPER-SMT_2_NO_SILK  [SMT-JUMPER_2_NO_SILK]
R48  330R  R-EU_330R0603  [R0603]
R49  10k  R-EU_P10KR0603  [R0603]
R50  10k  R-EU_P10KR0603  [R0603]
R51  R-EU_R0402  [R0402]
RTC1  DS3231M  [SO08]
U30  MCP4726A2SOT-23  [SOT23-6L]
U31  BME280  [BME280]
U32  PAC1934QFN  [QFN16]
U33  ADS1115  [VSSOP_10]
U38  MLX90393  [QFN16_3X3]
U43  BMA456  [LGA-12_2X2]
U44  VEML6030  [VEML6030]

### Nets
3V3_AUX: C32.1 C38.1 C46.1 C47.1 C48.1 C57.1 RTC1.2(VCC) U31.2(CSB) U31.5(SDO) U31.6(VDDIO) U31.8(VDD) U38.2(MS/CS) U38.8(VDD_IO) U38.15(VDD) U43.3(VCC) U43.7(VCC) U43.10(VCC) U44.4(ADDR) U44.6(VDD) ; supply symbol labelled VCC ; also sheet 1,2,3,4
3V3_CORE: C35.1 U32.2(VDD) U32.15(VDD_IO) U32.16(!PWRDN) ; also sheet 1,2,3,4,6
5V_AUX: C29.1 C30.1 C36.1 R48.2 U30.3(VDD) U33.1(ADDR) U33.8(VDD) ; also sheet 1,2,3,4,6
ADC_0: U33.4(AIN0) ; also sheet 3
ADC_1: JP6.1 U33.5(AIN1) ; also sheet 3
ADC_2: U33.6(AIN2) ; also sheet 3
ADC_3: JP7.1 U33.7(AIN3) ; also sheet 3
ADC_EXT_ALERT: U33.2(ALERT) ; also sheet 6
CSA_!ALERT: U32.1(SLOW/!ALERT) ; also sheet 6
DAC_OUT: C33.1 U30.1(VOUT) ; also sheet 3
GND: BT1.GND(-) C29.2 C30.2 C31.2 C32.2 C33.2 C34.2 C35.2 C36.2 C38.2 C46.2 C47.2 C48.2 C57.2 D6.2(A) R49.1 R50.1 R51.1 RTC1.5(GND) U30.2(VSS) U31.1(GND) U31.7(GND) U32.3(GND) U32.EP(GND) U33.3(GND) U38.4(VSS) U38.9(VSS) U38.10(VSS) U38.11(A1) U38.12(A0) U38.13(VSS) U38.14(VSS) U38.16(VSS) U38.EP(VSS) U43.1(GND) U43.8(GND) U43.9(GND) U44.1(GND) ; also sheet 1,2,3,4,6
N$21: R51.2 U32.6(ADDR_SEL)
N$43: BT1.POWER0(+) BT1.POWER1(+) C34.1 RTC1.6(VBAT)
N$65: JP6.2 R49.2
N$66: JP7.2 R50.2
RTC_INT: RTC1.3(SQW) ; also sheet 6
SCL: RTC1.8(SCL) U31.4(SCK) U32.4(CLK) U38.3(SCL/SCLK) U43.12(SCL) U44.5(SCL) ; also sheet 3,4,6
SCL_5V: U30.5(SCL) U33.10(SCL) ; also sheet 4
SDA_5V: U30.4(SDA) U33.9(SDA) ; also sheet 4
SDA_OB: RTC1.7(SDA) U31.3(SDI) U32.5(DATA) U38.5(SDA/MOSI) U43.2(SDA) U44.2(SDA) ; also sheet 3,4,6
SENSOR_INT: U43.5(INT)
V_BETA: U32.7(SENSE3-) ; also sheet 1,2
V_BETA_SENSE: U32.8(SENSE3+) ; also sheet 1
V_LI: U32.13(SENSE2+) ; also sheet 1
V_LI_SENSE: U32.14(SENSE2-) ; also sheet 1
V_PRIME: U32.12(SENSE1-) ; also sheet 1,2,3
V_PRIME_SENSE: U32.11(SENSE1+) ; also sheet 3
V_SOLAR_IN: U32.9(SENSE4-) ; also sheet 1
V_SOLAR_SENSE: U32.10(SENSE4+) ; also sheet 1
VREF: C31.1 D6.1(C) R48.1 U30.6(VREF) ; also sheet 3
Unconnected: RTC1.1(32KHZ) RTC1.4(RST) U38.1(INT) U38.6(MISO) U38.7(INT/TRG) U44.3(INT)

### Notes on the sheet
- ADR=0x10 - FLEX
- ADR=0x62
- ADR = 0x49
- ADR = 0x48
- ADR=0x77
- ADR=0x68
- ADR=0x18
- ADR=0x0C

## Sheet 6 of 6
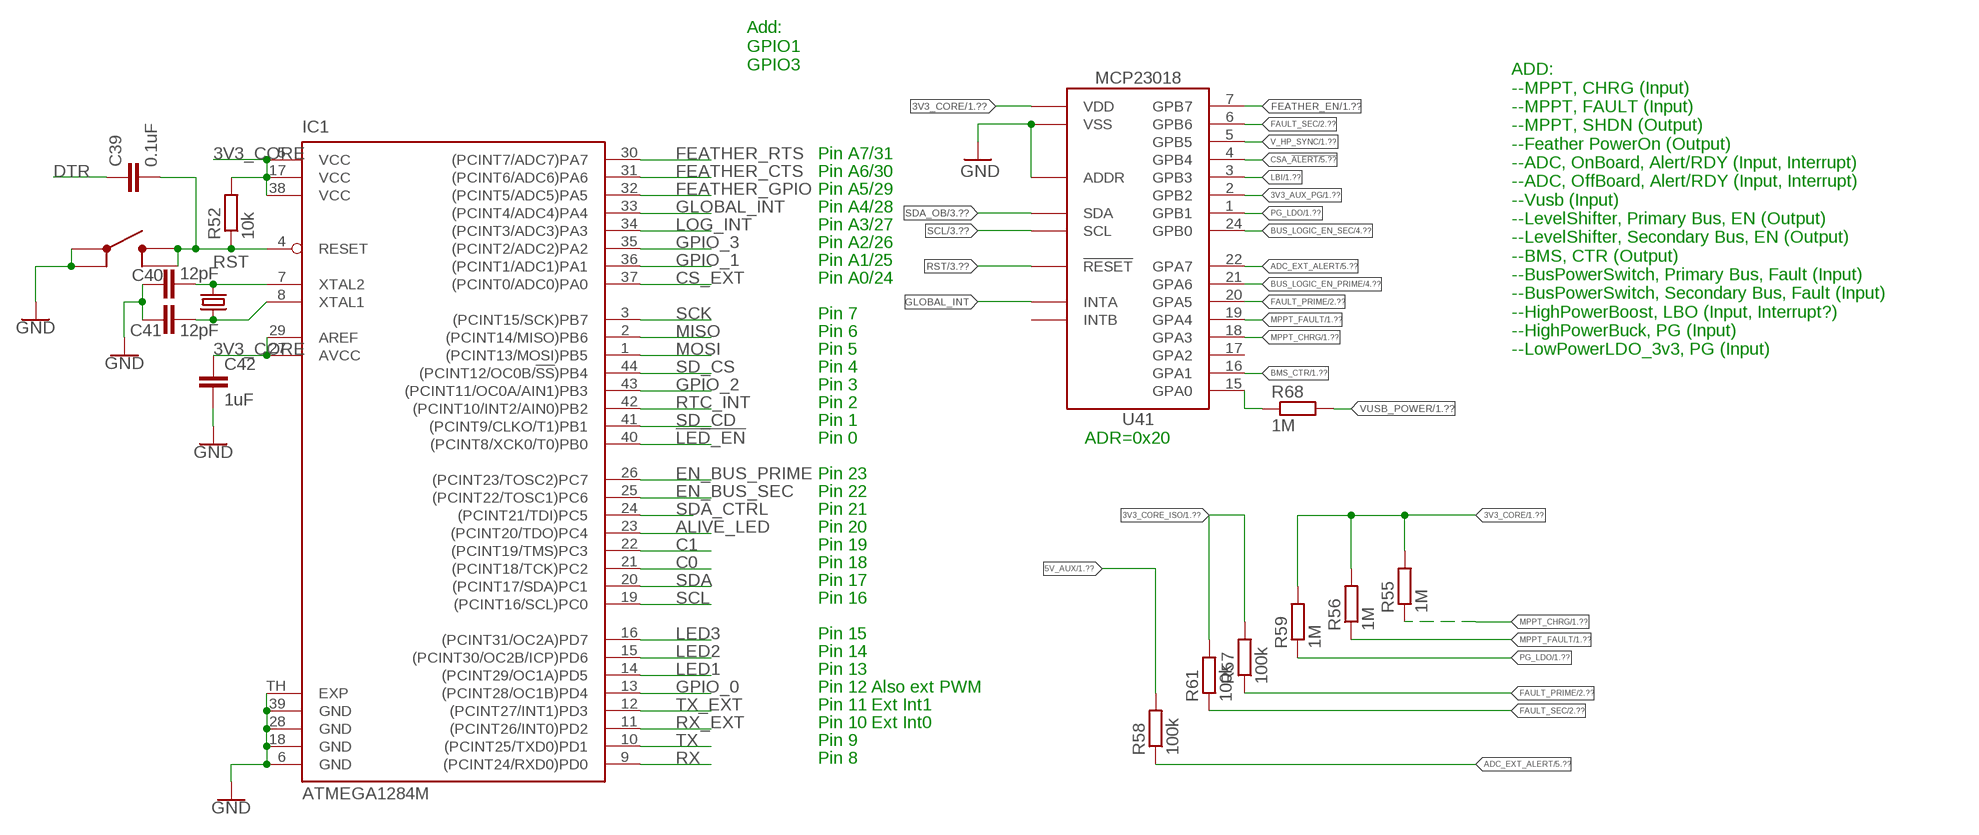
[diagram p5: schematic, sheet 6]

### Parts
C39  0.1uF  C-EU0.1UFC0402  [C0402]
C40  12pF  C-EU12PFC0402  [C0402]
C41  12pF  C-EU12PFC0402  [C0402]
C42  1uF  C-EU0.1UFC0402  [C0402]
IC1  ATMEGA1284M  [MLF44-TH]
R52  10k  R-EU_10KR0402  [R0402]
R55  1M  R-EU_1MR0402  [R0402]
R56  1M  R-EU_1MR0402  [R0402]
R57  100k  R-EU_100KR0402  [R0402]
R58  100k  R-EU_100KR0402  [R0402]
R59  1M  R-EU_1MR0402  [R0402]
R61  100k  R-EU_100KR0402  [R0402]
R68  1M  R-EU_1MR0402  [R0402]
S4  BUTTON4.2X3.2  [SWITCH_4.2X3.2]
U41  MCP23018QFN  [QFN24]
XTAL1  CRYSTAL8MHZ5X3.2  [CRYSTAL_5X3.2_2-SMD]

### Nets
3V3_AUX_PG: U41.2(GPB2) ; also sheet 1
3V3_CORE: C42.1 IC1.5(VCC) IC1.17(VCC) IC1.27(AVCC) IC1.29(AREF) IC1.38(VCC) R52.2 R55.2 R56.2 R59.2 U41.8(VDD) ; also sheet 1,2,3,4,5
3V3_CORE_ISO: R57.2 R61.2 ; also sheet 1,4
5V_AUX: R58.2 ; also sheet 1,2,3,4,5
!LED_EN: IC1.40((PCINT8/XCK0/T0)PB0) ; also sheet 3
ADC_EXT_ALERT: R58.1 U41.22(GPA7) ; also sheet 5
ALIVE_LED: IC1.23((PCINT20/TDO)PC4) ; also sheet 2
BMS_CTR: U41.16(GPA1) ; also sheet 1
BUS_LOGIC_EN_PRIME: U41.21(GPA6) ; also sheet 4
BUS_LOGIC_EN_SEC: U41.24(GPB0) ; also sheet 4
C0: IC1.21((PCINT18/TCK)PC2) ; also sheet 2
C1: IC1.22((PCINT19/TMS)PC3) ; also sheet 2
CS_EXT: IC1.37((PCINT0/ADC0)PA0) ; also sheet 4
CSA_!ALERT: U41.4(GPB4) ; also sheet 5
DTR: C39.1 ; also sheet 2
EN_BUS_PRIME: IC1.26((PCINT23/TOSC2)PC7) ; also sheet 2
EN_BUS_SEC: IC1.25((PCINT22/TOSC1)PC6) ; also sheet 2
FAULT_PRIME: R57.1 U41.20(GPA5) ; also sheet 2
FAULT_SEC: R61.1 U41.6(GPB6) ; also sheet 2
FEATHER_CTS: IC1.31((PCINT6/ADC6)PA6) ; also sheet 3
FEATHER_EN: U41.7(GPB7) ; also sheet 1
FEATHER_GPIO: IC1.32((PCINT5/ADC5)PA5) ; also sheet 3
FEATHER_RTS: IC1.30((PCINT7/ADC7)PA7) ; also sheet 3
GLOBAL_INT: IC1.33((PCINT4/ADC4)PA4) U41.14(INTA)
GND: C40.1 C41.1 C42.2 IC1.6(GND) IC1.18(GND) IC1.28(GND) IC1.39(GND) IC1.TH(EXP) S4.1 S4.2 U41.11(ADDR) U41.23(VSS) U41.EP(VSS) ; also sheet 1,2,3,4,5
GPIO_0: IC1.13((PCINT28/OC1B)PD4) ; also sheet 4
GPIO_1: IC1.36((PCINT1/ADC1)PA1) ; also sheet 4
GPIO_2: IC1.43((PCINT11/OC0A/AIN1)PB3) ; also sheet 4
GPIO_3: IC1.35((PCINT2/ADC2)PA2) ; also sheet 4
LBI: U41.3(GPB3) ; also sheet 1
LED1: IC1.14((PCINT29/OC1A)PD5) ; also sheet 3
LED2: IC1.15((PCINT30/OC2B/ICP)PD6) ; also sheet 3
LED3: IC1.16((PCINT31/OC2A)PD7) ; also sheet 3
LOG_INT: IC1.34((PCINT3/ADC3)PA3) ; also sheet 3
MISO: IC1.2((PCINT14/MISO)PB6) ; also sheet 3,4
MOSI: IC1.1((PCINT13/MOSI)PB5) ; also sheet 3,4
MPPT_CHRG: R55.1 U41.18(GPA3) ; also sheet 1
MPPT_FAULT: R56.1 U41.19(GPA4) ; also sheet 1
N$17: R68.1 U41.15(GPA0)
N$61: C40.2 IC1.7(XTAL2) XTAL1.OSC2
N$62: C41.2 IC1.8(XTAL1) XTAL1.OSC1
PG_LDO: R59.1 U41.1(GPB1) ; also sheet 1
RST: C39.2 IC1.4(RESET) R52.1 S4.3 S4.4 U41.12(!RESET) ; also sheet 3
RTC_INT: IC1.42((PCINT10/INT2/AIN0)PB2) ; also sheet 5
RX: IC1.9((PCINT24/RXD0)PD0) ; also sheet 2,3
RX_EXT: IC1.11((PCINT26/INT0)PD2) ; also sheet 4
SCK: IC1.3((PCINT15/SCK)PB7) ; also sheet 3,4
SCL: IC1.19((PCINT16/SCL)PC0) U41.9(SCL) ; also sheet 3,4,5
SD_CD: IC1.41((PCINT9/CLKO/T1)PB1) ; also sheet 3
SD_CS: IC1.44((PCINT12/OC0B/!SS!)PB4) ; also sheet 4
SDA: IC1.20((PCINT17/SDA)PC1) ; also sheet 4
SDA_CTRL: IC1.24((PCINT21/TDI)PC5) ; also sheet 4
SDA_OB: U41.10(SDA) ; also sheet 3,4,5
TX: IC1.10((PCINT25/TXD0)PD1) ; also sheet 2,3
TX_EXT: IC1.12((PCINT27/INT1)PD3) ; also sheet 4
V_HP_SYNC: U41.5(GPB5) ; also sheet 1
VUSB_POWER: R68.2 ; also sheet 1,2
Unconnected: U41.13(INTB) U41.17(GPA2)

### Notes on the sheet
- Add:
  GPIO1
  GPIO3
- Pin A7/31
- Pin A6/30
- Pin A5/29
- Pin A4/28
- Pin A3/27
- Pin A2/26
- Pin A1/25
- Pin A0/24
- Pin 7
- Pin 6
- Pin 5
- ADD:
  --MPPT, CHRG (Input)
  --MPPT, FAULT (Input)
  --MPPT, SHDN (Output)
  --Feather PowerOn (Output)
  --ADC, OnBoard, Alert/RDY (Input, Interrupt)
  --ADC, OffBoard, Alert/RDY (Input, Interrupt)
  --Vusb (Input)
  --LevelShifter, Primary Bus, EN (Output)
  --LevelShifter, Secondary Bus, EN (Output)
  --BMS, CTR (Output)
  --BusPowerSwitch, Primary Bus, Fault (Input)
  --BusPowerSwitch, Secondary Bus, Fault (Input)
  --HighPowerBoost, LBO (Input, Interrupt?)
  --HighPowerBuck, PG (Input)
  --LowPowerLDO_3v3, PG (Input)
- Pin 4
- Pin 3
- Pin 2
- Pin 1
- Pin 0 | ADR=0x20
- Pin 23
- Pin 22
- Pin 21
- Pin 20
- Pin 19
- Pin 18
- Pin 17
- Pin 16
- Pin 15
- Pin 14
- Pin 13
- Pin 12 | Also ext PWM
- Pin 11 | Ext Int1
- Pin 10 | Ext Int0
- Pin 9
- Pin 8

## Power pins joined to a net without a drawn wire
QOD: U21.5(QOD) U22.5(QOD)
SIM_VCC: J9.67(SIM_VCC)
UB_VBUS: J9.74(UB_VBUS)